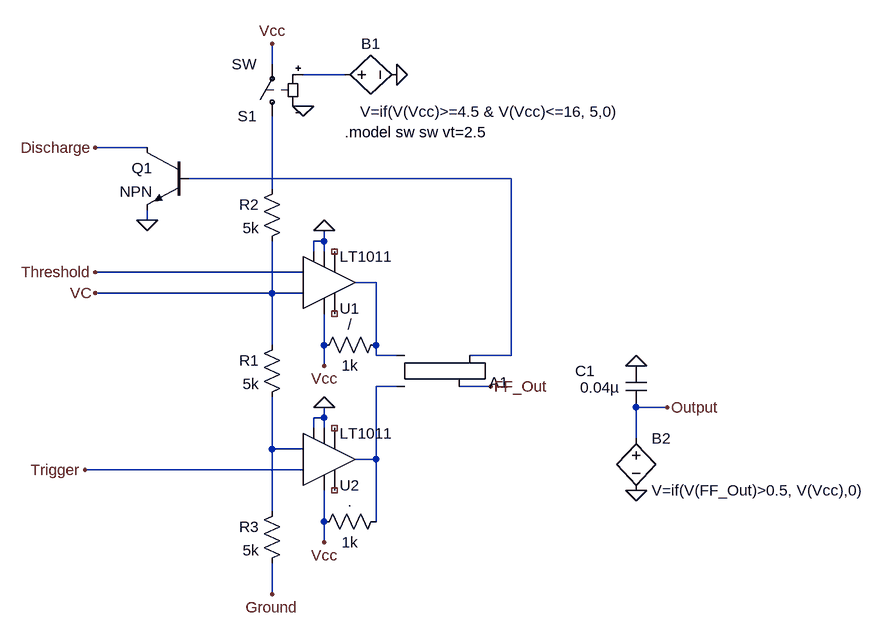
[diagram p0: schematic NE555 sch.asc]
NE555 sch.asc, the LTspice schematic file:
Version 4
SHEET 1 1596 680
WIRE -96 -368 -96 -400
WIRE 16 -352 -48 -352
WIRE -288 -240 -368 -240
WIRE 272 -192 -224 -192
WIRE -96 -176 -96 -288
WIRE -288 -128 -288 -144
WIRE -16 -96 -16 -112
WIRE -16 -96 -32 -96
WIRE -32 -80 -32 -96
WIRE -16 -80 -16 -96
WIRE -48 -48 -368 -48
WIRE 64 -32 32 -32
WIRE -96 -16 -96 -96
WIRE -96 -16 -368 -16
WIRE -48 -16 -96 -16
WIRE -96 64 -96 -16
WIRE -16 64 -16 16
WIRE 64 64 64 -32
WIRE 64 80 64 64
WIRE 96 80 64 80
WIRE 272 80 272 -192
WIRE 272 80 208 80
WIRE -16 96 -16 64
WIRE 96 128 64 128
WIRE 240 128 192 128
WIRE 512 160 464 160
WIRE -16 176 -16 160
WIRE -16 176 -32 176
WIRE -32 192 -32 176
WIRE -16 192 -16 176
WIRE 464 208 464 160
WIRE -96 224 -96 144
WIRE -48 224 -96 224
WIRE 64 240 64 128
WIRE 64 240 32 240
WIRE -48 256 -384 256
WIRE -96 320 -96 224
WIRE -16 336 -16 288
WIRE 64 336 64 240
WIRE -16 368 -16 336
WIRE -96 448 -96 400
FLAG -16 96 Vcc
FLAG -16 368 Vcc
FLAG -96 -400 Vcc
FLAG 512 160 Output
FLAG -368 -48 Threshold
FLAG -368 -240 Discharge
FLAG -384 256 Trigger
FLAG -368 -16 VC
FLAG -96 448 Ground
FLAG -16 -112 0
FLAG -16 160 0
FLAG -288 -128 0
FLAG -48 -304 0
FLAG 96 -352 0
FLAG 464 96 0
FLAG 464 288 0
FLAG 240 128 FF_Out
SYMBOL Digital\\srflop 144 176 M180
SYMATTR InstName A1
SYMBOL Comparators\\LT1011 -16 -32 M180
SYMATTR InstName U1
SYMBOL Comparators\\LT1011 -16 240 M180
SYMATTR InstName U2
SYMBOL npn -224 -240 M0
SYMATTR InstName Q1
SYMBOL res -80 48 M0
SYMATTR InstName R1
SYMATTR Value 5k
SYMBOL res -80 -192 M0
SYMATTR InstName R2
SYMATTR Value 5k
SYMBOL res -80 304 M0
SYMATTR InstName R3
SYMATTR Value 5k
SYMBOL res 80 48 R90
WINDOW 0 0 56 VBottom 2
WINDOW 3 32 56 VTop 2
SYMATTR InstName /
SYMATTR Value 1k
SYMBOL res 80 320 R90
WINDOW 0 0 56 VBottom 2
WINDOW 3 32 56 VTop 2
SYMATTR InstName .
SYMATTR Value 1k
SYMBOL sw -96 -272 R180
SYMATTR InstName S1
SYMBOL bv 0 -352 R270
WINDOW 0 32 56 VTop 2
WINDOW 3 -41 238 VBottom 2
SYMATTR InstName B1
SYMATTR Value V=if(V(Vcc)>=4.5 & V(Vcc)<=16, 5,0)
SYMBOL cap 480 160 R180
WINDOW 0 79 56 Left 2
WINDOW 3 41 31 Left 2
SYMATTR InstName C1
SYMATTR Value 0.04µ
SYMBOL bv 464 192 R0
SYMATTR InstName B2
SYMATTR Value V=if(V(FF_Out)>0.5, V(Vcc),0)
TEXT 16 -264 Left 2 !.model sw sw vt=2.5

The netlist it stands for:
* NE555 sch.asc
A1 N005 N004 0 0 0 N002 FF_Out 0 SRFLOP
XU1 0 Threshold VC 0 NC_01 NC_02 N004 Vcc LT1011
XU2 0 N006 Trigger 0 NC_03 NC_04 N005 Vcc LT1011
Q1 Discharge N002 0 0 NPN
R1 VC N006 5k
R2 N003 VC 5k
R3 N006 Ground 5k
R§/ N004 Vcc 1k
R§. N005 Vcc 1k
S1 N003 Vcc N001 0 SW
B1 N001 0 V=if(V(Vcc)>=4.5 & V(Vcc)<=16, 5,0)
C1 Output 0 0.04µ
B2 Output 0 V=if(V(FF_Out)>0.5, V(Vcc),0)
.model NPN NPN
.model PNP PNP
.lib standard.bjt
.model sw sw vt=2.5
.lib LTC1.lib
.backanno
.end